# Altium schematic sheet SheetMotor.SchDoc
size A; DocumentNumber: 4; SheetNumber: 4; SheetTotal: 5
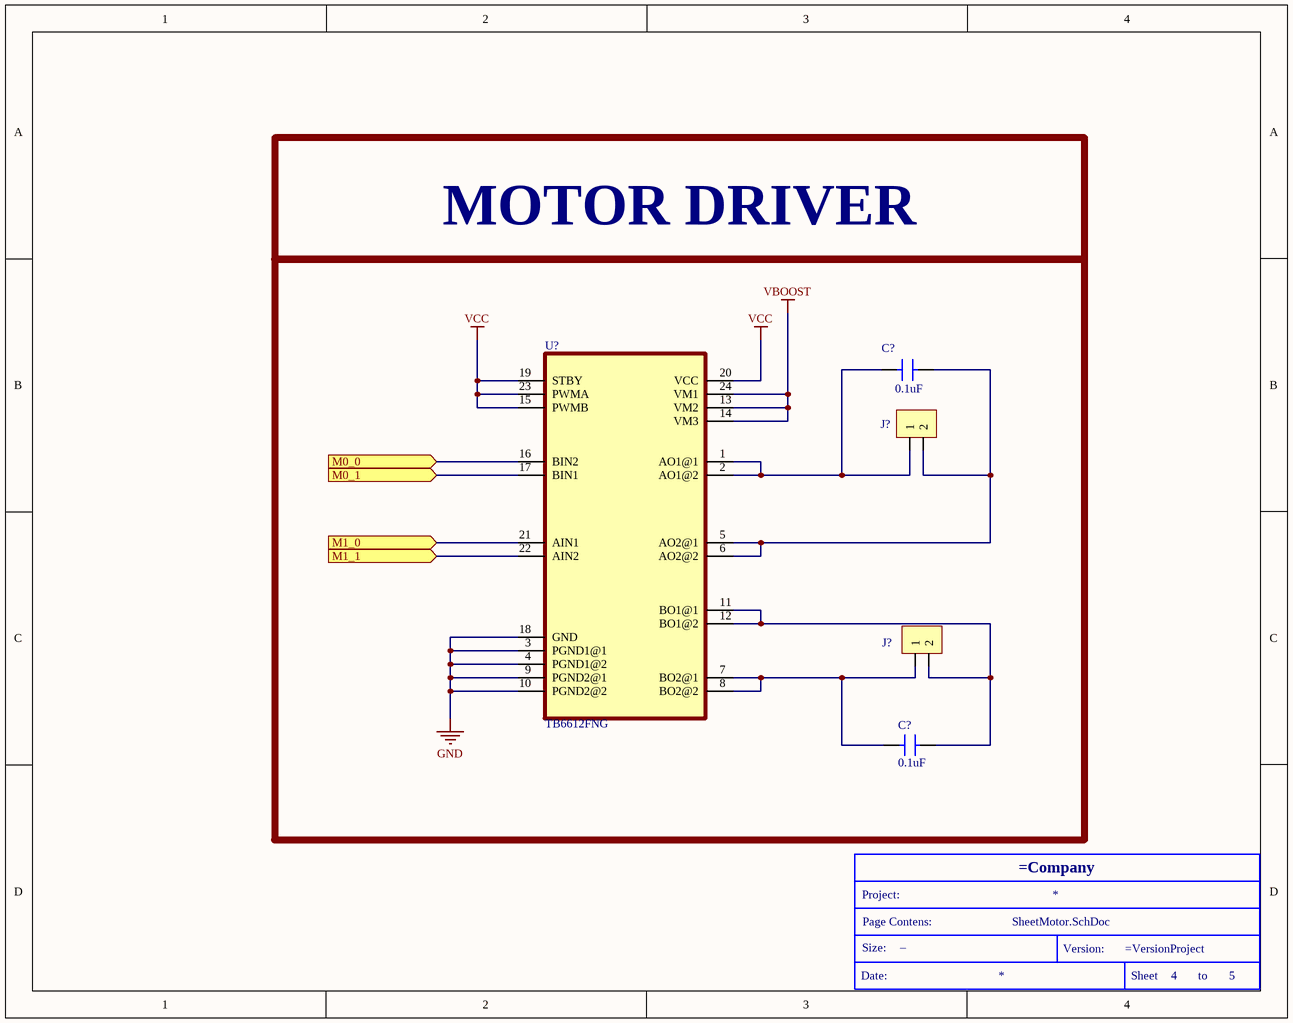
[diagram p0: SheetMotor.SchDoc]

## Parts
(Parts that share a designator on the sheet are numbered #1, #2 ... from top to bottom, then left to right.)
*  SizePage: _  (hidden comment: TitleBlock)  (graphical)
C?#1  0.1uF  [CAP104 0.1UF 50V]
C?#2  0.1uF  [CAP104 0.1UF 50V]
J?#1  Pad IO Motor  [Pad IO Motor]  (value not drawn)
J?#2  Pad IO Motor  [Pad IO Motor]  (value not drawn)
U?  TB6612FNG  [SOP65P760X160-24N]

## Ports
M0_0 (in), M0_1 (in), M1_0 (in), M1_1 (in)

## Nets
GND: U?.3(PGND1@1) U?.4(PGND1@2) U?.9(PGND2@1) U?.10(PGND2@2) U?.18(GND)
VBOOST: U?.13(VM2) U?.14(VM3) U?.24(VM1)
VCC: U?.15(PWMB) U?.19(STBY) U?.20(VCC) U?.23(PWMA)
M0_0: U?.16(BIN2) ; port M0_0
M0_1: U?.17(BIN1) ; port M0_1
M1_0: U?.21(AIN1) ; port M1_0
M1_1: U?.22(AIN2) ; port M1_1
NetC?#1_1: C?#1.1 J?#1.1 U?.1(AO1@1) U?.2(AO1@2)
NetC?#1_2: C?#1.2 J?#1.2 U?.5(AO2@1) U?.6(AO2@2)
NetC?#2_1: C?#2.1 J?#2.1 U?.7(BO2@1) U?.8(BO2@2)
NetC?#2_2: C?#2.2 J?#2.2 U?.11(BO1@1) U?.12(BO1@2)

## Notes on the sheet
- MOTOR DRIVER
- (in symbol TitleBlock) Project:; Page Contens:; Size:; Version:; Date:; Sheet; to

## Library data of the parts
C?#1 C?#2 = C0805C104K5RACTU: Cap Ceramic 0.1uF 50V X7R 10% SMD 2.0 x 1.2 mm 125 C Paper T/R; Manufacturer: KEMET; Capacitance: 100nF; Voltage: 500V; Supplier 1: Digi-Key; Manufacturer Part Number: C0805C104K5RACTU; Stock 1: 2487008; Pricing 1: 1 = 0.16000, 10 = 0.11500, 50 = 0.06540, 100 = 0.05420, 500 = 0.03802, 1000 = 0.03147 (USD); RoHS: Yes; Mount: Surface Mount,PCB; Case/Package: 0805; Number of Pins: 2; Dielectric Material: Ceramic; Case Code (Imperial): 0805; Case Code (Metric): 2012; Contact Plating: Tin,Matte; Min Operating Temperature: -55°C; Max Operating Temperature: 125°C; Tolerance: 10%; Packaging: Tape and Reel; Voltage Rating (DC): 50V; Dielectric: X7R; Termination: SMD/SMT; Package Quantity: 4000; Voltage Rating: 50V; Length: 2mm; Height: 0.9mm; Width: 1.2mm; Lead Pitch: 0.75mm; Depth: 1.25mm; Thickness: 0.035inch; Radiation Hardening: No; REACH SVHC: No SVHC; ComponentLink1URL: https://datasheet.ciiva.com/14589/70095383-14589048.pdf?src-supplier=Allied+Electronics; ComponentLink1Description: https://datasheet.ciiva.com/14589/70095383-14589048.pdf?src-supplier=Allied+Electronics; ComponentLink2URL: https://datasheet.ciiva.com/28682/1851736-28682232.pdf?src-supplier=Element14; ComponentLink2Description: https://datasheet.ciiva.com/28682/1851736-28682232.pdf?src-supplier=Element14; ComponentLink3URL: https://datasheet.ciiva.com/32431/slceramic-chip-condensers-e-32431755.pdf?src-supplier=Distrelec; ComponentLink3Description: https://datasheet.ciiva.com/32431/slceramic-chip-condensers-e-32431755.pdf?src-supplier=Distrelec; ComponentLink4URL: https://datasheet.ciiva.com/18410/70095383-18410815.pdf?src-supplier=Allied+Electronics; ComponentLink4Description: https://datasheet.ciiva.com/18410/70095383-18410815.pdf?src-supplier=Allied+Electronics; Supplier Part Number 1: 399-1170-1-ND
U? = TB6612FNG,C,8,EL: IC MOTOR DRIVER PAR 24SSOP; Manufacturer: Toshiba; Number of Outputs: 2; Min Supply Voltage: 2.7V; Operating Supply Voltage: 3V; Max Supply Voltage: 5.5V; Output Current: 1A; Logic Function: AND GATE; Interface: Parallel; Supplier 1: Digi-Key; Manufacturer Part Number: TB6612FNG,C,8,EL; Stock 1: 54784; Pricing 1: 1 = 2.06000, 10 = 1.85400, 25 = 1.74880, 100 = 1.49010, 250 = 1.39920, 500 = 1.22430, 1000 = 1.01442 (USD); RoHS: Yes; Mount: Surface Mount; Case/Package: SSOP; Number of Pins: 24; Min Operating Temperature: -20°C; Max Operating Temperature: 85°C; Package Quantity: 1; Packaging: Tape and Reel; ComponentLink1URL: https://datasheet.ciiva.com/12216/tb6612fng-datasheet-en-20141001-12216529.pdf?src-supplier=Mouser; ComponentLink1Description: https://datasheet.ciiva.com/12216/tb6612fng-datasheet-en-20141001-12216529.pdf?src-supplier=Mouser; Supplier Part Number 1: TB6612FNGC8ELCT-ND